# Altium schematic sheet receiver_car.SchDoc
size A4
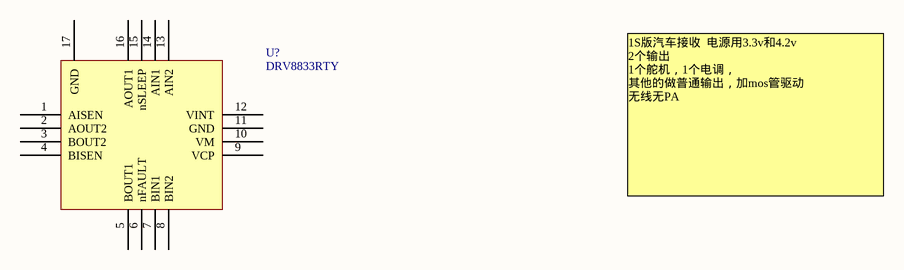
[diagram p0: receiver_car.SchDoc]

## Parts
U?  DRV8833RTY  [QFN-16 - duplicate1]

## Nets

Not connected (* = marked no-connect by the designer): U? 1(AISEN) 2(AOUT2) 3(BOUT2) 4(BISEN) 5(BOUT1) 6(nFAULT) 7(BIN1) 8(BIN2) 9(VCP) 10(VM) 11(GND) 12(VINT) 13(AIN2) 14(AIN1) 15(nSLEEP) 16(AOUT1) 17(GND)

## Notes on the sheet
- 1S版汽车接收  电源用3.3v和4.2v
  2个输出
  1个舵机，1个电调，
  其他的做普通输出，加mos管驱动
  无线无PA

## Library data of the parts
U? = DRV8833RTY: DRV8833_QFN封装